# Altium project WSN_NODE.PrjPCB
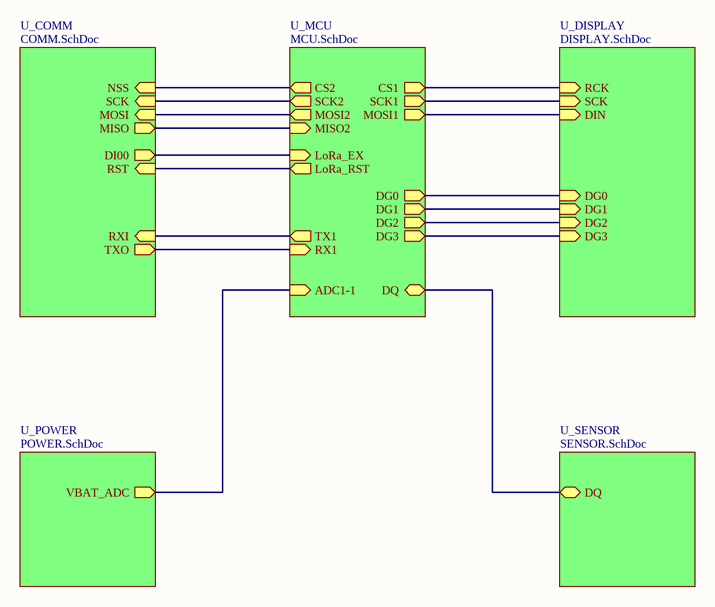
[diagram p0: CONN.SchDoc]
6 sheets, 79 parts. Net scope: hierarchical (ports join the sheet entries above them; power ports are global).
Board file: WSN_PCB_NODE.PcbDoc
Sheets:
  CONN.SchDoc
    U_COMM = COMM.SchDoc
    U_DISPLAY = DISPLAY.SchDoc
    U_MCU = MCU.SchDoc
    U_POWER = POWER.SchDoc
    U_SENSOR = SENSOR.SchDoc

## Sheet CONN.SchDoc: =ProjectName
size A4; CheckedBy: DatNB; Author: Ven; CompanyName: Nacentech; Organization: IMET

### Sub-sheets
U_COMM = COMM.SchDoc: SCK (in), MISO (out), NSS (in), RST (in), TXO (out), RXI (in), DI00 (out), MOSI (in)
U_DISPLAY = DISPLAY.SchDoc: DIN (in), RCK (in), SCK (in), DG0 (in), DG1 (in), DG2 (in), DG3 (in)
U_MCU = MCU.SchDoc: ADC1-1 (in), CS1 (out), SCK1 (out), MOSI1 (out), CS2 (out), TX1 (out), RX1 (in), LoRa_EX (in), SCK2 (out), MISO2 (in), MOSI2 (out), LoRa_RST (out), DG0 (out), DG2 (out), DG3 (out), DG1 (out), DQ (bidir)
U_POWER = POWER.SchDoc: VBAT_ADC (out)
U_SENSOR = SENSOR.SchDoc: DQ (bidir)

### Nets
PA1: sheet U_MCU/ADC1-1, sheet U_POWER/VBAT_ADC
PA4: sheet U_DISPLAY/RCK, sheet U_MCU/CS1
PA5: sheet U_DISPLAY/SCK, sheet U_MCU/SCK1
PA7: sheet U_DISPLAY/DIN, sheet U_MCU/MOSI1
PA8: sheet U_COMM/NSS, sheet U_MCU/CS2
PA9: sheet U_COMM/RXI, sheet U_MCU/TX1
PA10: sheet U_COMM/TXO, sheet U_MCU/RX1
PB0: sheet U_MCU/DQ, sheet U_SENSOR/DQ
PB8: sheet U_DISPLAY/DG0, sheet U_MCU/DG0
PB9: sheet U_DISPLAY/DG1, sheet U_MCU/DG1
PB10: sheet U_DISPLAY/DG2, sheet U_MCU/DG2
PB11: sheet U_DISPLAY/DG3, sheet U_MCU/DG3
PB12: sheet U_COMM/DI00, sheet U_MCU/LoRa_EX
PB13: sheet U_COMM/SCK, sheet U_MCU/SCK2
PB14: sheet U_COMM/MISO, sheet U_MCU/MISO2
PB15: sheet U_COMM/MOSI, sheet U_MCU/MOSI2
NetU2_4: sheet U_COMM/RST, sheet U_MCU/LoRa_RST

### Notes on the sheet
- Project:
- Page Contents:
- Size:
- Date:
- A4
- Checked by:
- Time:
- Revision:
- Sheet
- of
- File:

## Sheet COMM.SchDoc: =ProjectName
size A4; CheckedBy: DatNB; Author: Ven; CompanyName: Nacentech; Organization: IMET
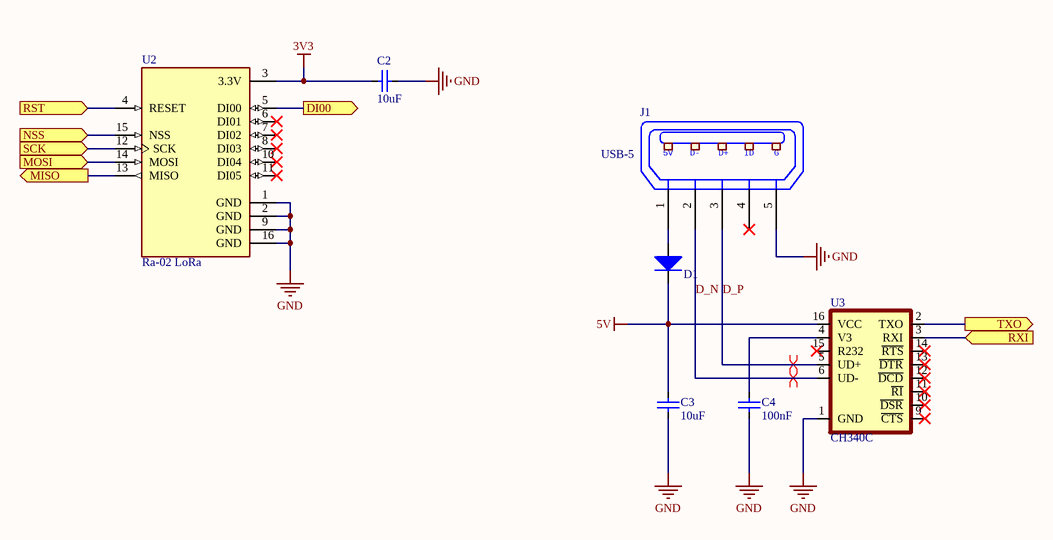
[diagram p1: COMM.SchDoc]

### Parts
C2  10uF  [CAP_0805]
C3  10uF  [CAP_0805]
C4  100nF  [CAP_0805]
D1  Diode SMD  [DIO-214AC(SMA)]  (value not drawn)
J1  USB-5  [USB-M1]
U2  Ra-02 LoRa  [Ra-02]
U3  CH340C  [SOP-16]

### Ports
DI00 (out), MISO (out), MOSI (in), NSS (in), RST (in), RXI (in), SCK (in), TXO (out)

### Nets
3V3: C2.2 U2.3(3.3V)
5V: C3.2 D1.2(K) U3.16(VCC)
GND: C2.1 C3.1 C4.1 J1.5(P5) U2.1(GND) U2.2(GND) U2.9(GND) U2.16(GND) U3.1(GND)
D_N: J1.2(P2) U3.6(UD-)
D_P: J1.3(P3) U3.5(UD+)
PA8: U2.15(NSS) ; port NSS
PA9: U3.3(RXI) ; port RXI
PA10: U3.2(TXO) ; port TXO
PB12: U2.5(DI00) ; port DI00
PB13: U2.12(SCK) ; port SCK
PB14: U2.13(MISO) ; port MISO
PB15: U2.14(MOSI) ; port MOSI
NetC4_2: C4.2 U3.4(V3)
NetD1_1: D1.1(A) J1.1(P1)
NetU2_4: U2.4(RESET) ; port RST

Not connected (* = marked no-connect by the designer): J1 4(P4)*; U2 6(DI01)* 7(DI02)* 8(DI03)* 10(DI04)* 11(DI05)*; U3 9(~{CTS})* 10(~{DSR})* 11(~{RI})* 12(~{DCD})* 13(~{DTR})* 14(~{RTS})* 15(R232)*

### Layout directives
differential pair: D_N, D_P

### Notes on the sheet
- Project:
- Page Contents:
- Size:
- Date:
- A4
- Checked by:
- Time:
- Revision:
- Sheet
- of
- File:
- (in symbol USB-5) 5V; D-; D+; ID; G

### Library data of the parts
C2-C4 = CapSMD: Capacitor; Value: 33p; Published: 8-Jun-2000; LatestRevisionDate: 17-Jul-2002; LatestRevisionNote: Re-released for DXP Platform.; PackageReference: RAD-0.3; Publisher: Altium Limited
D1 = Diode SMD: Default Diode; Code - JEDEC: DO-214-AB; Value: 1N5007; Published: 8-Jun-2000; Revision: July-2002: Re-released for DXP Platform.; Publisher: Altium Limited
J1 = USB-5: Manufacturer: FCI; Manufacturer Part Number: 10118193-0001LF; Connector Type: USB - micro B; Number of Contacts: 5; Gender: Receptacle; Specifications: USB 2.0; .Creator: MM; .Checked PCB: RF; Supplier 1: Digi-Key; RoHS: RoHS Compliant; Category: Connectors, Interconnects; Stock 1: 28642; Pricing 1: 1=0.46, 10=0.433, 25=0.3712, 50=0.3156, 100=0.3032, 250=0.27224, 500=0.25988 (USD); Packaging: Cut Tape (CT); Mounting Type: Surface Mount, Right Angle, Horizontal; Features: Shielded, Solder Retention; Ingress Protection: -; ComponentLink1URL: http://portal.fciconnect.com/Comergent//fci/drawing/10118193.pdf; ComponentLink1Description: http://portal.fciconnect.com/Comergent//fci/drawing/10118193.pdf; Supplier Part Number 1: 609-4616-1-ND; .Checked SCH: MM
U2 = Ra-02 LoRa: LoRa Module Ra-02
U3 = CH340C: USB to serial chip CH340; MF: WCH; Package: Package; Check_prices: https://www.snapeda.com/parts/CH340C/WCH/view-part/5428851/?ref=eda; Value: *; Price: None; MP: CH340C; Availability: Unavailable; SnapEDA_Link: https://www.snapeda.com/parts/CH340C/WCH/view-part/5428851/?ref=snap

## Sheet DISPLAY.SchDoc: =ProjectName
size A4; CheckedBy: DatNB; Author: Ven; CompanyName: Nacentech; Organization: IMET
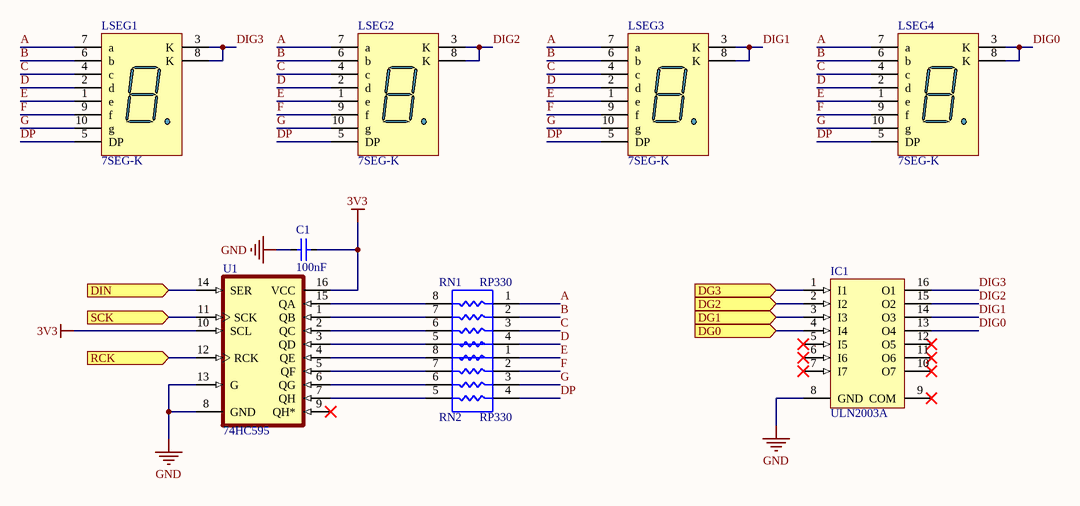
[diagram p2: DISPLAY.SchDoc]

### Parts
C1  100nF  [CAP_0805]
IC1  ULN2003A  [SOIC16]
LSEG1  7SEG-K  [LED7SEG]
LSEG2  7SEG-K  [LED7SEG]
LSEG3  7SEG-K  [LED7SEG]
LSEG4  7SEG-K  [LED7SEG]
RN1  RP330  [RN4-0805]
RN2  RP330  [RN4-0805]
U1  74HC595  [SOIC16]

### Ports
DG0 (in), DG1 (in), DG2 (in), DG3 (in), DIN (in), RCK (in), SCK (in)

### Nets
3V3: C1.1 U1.10(SCL) U1.16(VCC)
GND: C1.2 IC1.8(GND) U1.8(GND) U1.13(G)
A: LSEG1.7(a) LSEG2.7(a) LSEG3.7(a) LSEG4.7(a) RN1.1
B: LSEG1.6(b) LSEG2.6(b) LSEG3.6(b) LSEG4.6(b) RN1.2
C: LSEG1.4(c) LSEG2.4(c) LSEG3.4(c) LSEG4.4(c) RN1.3
D: LSEG1.2(d) LSEG2.2(d) LSEG3.2(d) LSEG4.2(d) RN1.4
DIG0: IC1.13(O4) LSEG4.3(K) LSEG4.8(K)
DIG1: IC1.14(O3) LSEG3.3(K) LSEG3.8(K)
DIG2: IC1.15(O2) LSEG2.3(K) LSEG2.8(K)
DIG3: IC1.16(O1) LSEG1.3(K) LSEG1.8(K)
DP: LSEG1.5(DP) LSEG2.5(DP) LSEG3.5(DP) LSEG4.5(DP) RN2.4
E: LSEG1.1(e) LSEG2.1(e) LSEG3.1(e) LSEG4.1(e) RN2.1
F: LSEG1.9(f) LSEG2.9(f) LSEG3.9(f) LSEG4.9(f) RN2.2
G: LSEG1.10(g) LSEG2.10(g) LSEG3.10(g) LSEG4.10(g) RN2.3
PA4: U1.12(RCK) ; port RCK
PA5: U1.11(SCK) ; port SCK
PA7: U1.14(SER) ; port DIN
PB8: IC1.4(I4) ; port DG0
PB9: IC1.3(I3) ; port DG1
PB10: IC1.2(I2) ; port DG2
PB11: IC1.1(I1) ; port DG3
NetRN1_5: RN1.5 U1.3(QD)
NetRN1_6: RN1.6 U1.2(QC)
NetRN1_7: RN1.7 U1.1(QB)
NetRN1_8: RN1.8 U1.15(QA)
NetRN2_5: RN2.5 U1.7(QH)
NetRN2_6: RN2.6 U1.6(QG)
NetRN2_7: RN2.7 U1.5(QF)
NetRN2_8: RN2.8 U1.4(QE)

Not connected (* = marked no-connect by the designer): IC1 5(I5)* 6(I6)* 7(I7)* 9(COM)* 10(O7)* 11(O6)* 12(O5)*; U1 9(QH*)*

### Notes on the sheet
- Project:
- Page Contents:
- Size:
- Date:
- A4
- Checked by:
- Time:
- Revision:
- Sheet
- of
- File:

### Library data of the parts
C1 = CapSMD: Capacitor; Value: 33p; Published: 8-Jun-2000; LatestRevisionDate: 17-Jul-2002; LatestRevisionNote: Re-released for DXP Platform.; PackageReference: RAD-0.3; Publisher: Altium Limited
IC1 = ULN2003A: High-Voltage, High-Current Darlington Array; LatestRevisionNote: Stylized 3D Model Added.; Publisher: Altium Limited; Value: ULN2003A
LSEG1-LSEG4 = LED7SEG-K: 14.2 mm General Purpose Blue 7-Segment Display: CC, RH DP, Gray Surface; MinimumIntensity: 2020 ucd; Note: IF = 10 mA; Published: 8-Jun-2000; LatestRevisionDate: 17-Dec-2003; LatestRevisionNote: Schematic revised, PCB Footprint replaced.; DatasheetDocument: 24-Sep-2002; PackageDocument: 24-Sep-2002; PackageReference: H; Publisher: Altium Limited; Colour: Blue; ComponentLink1Description: Manufacturer Link; ComponentLink1URL: http://www.agilent.com/
RN1 RN2 = RN4-Dual
U1 = 74HC595: 8-bit Serial-Input/Serial or Parallel Output Shift Register with Latched 3-state Outputs

## Sheet MCU.SchDoc: =ProjectName
size A4; CheckedBy: DatNB; Author: Ven; CompanyName: Nacentech; Organization: IMET
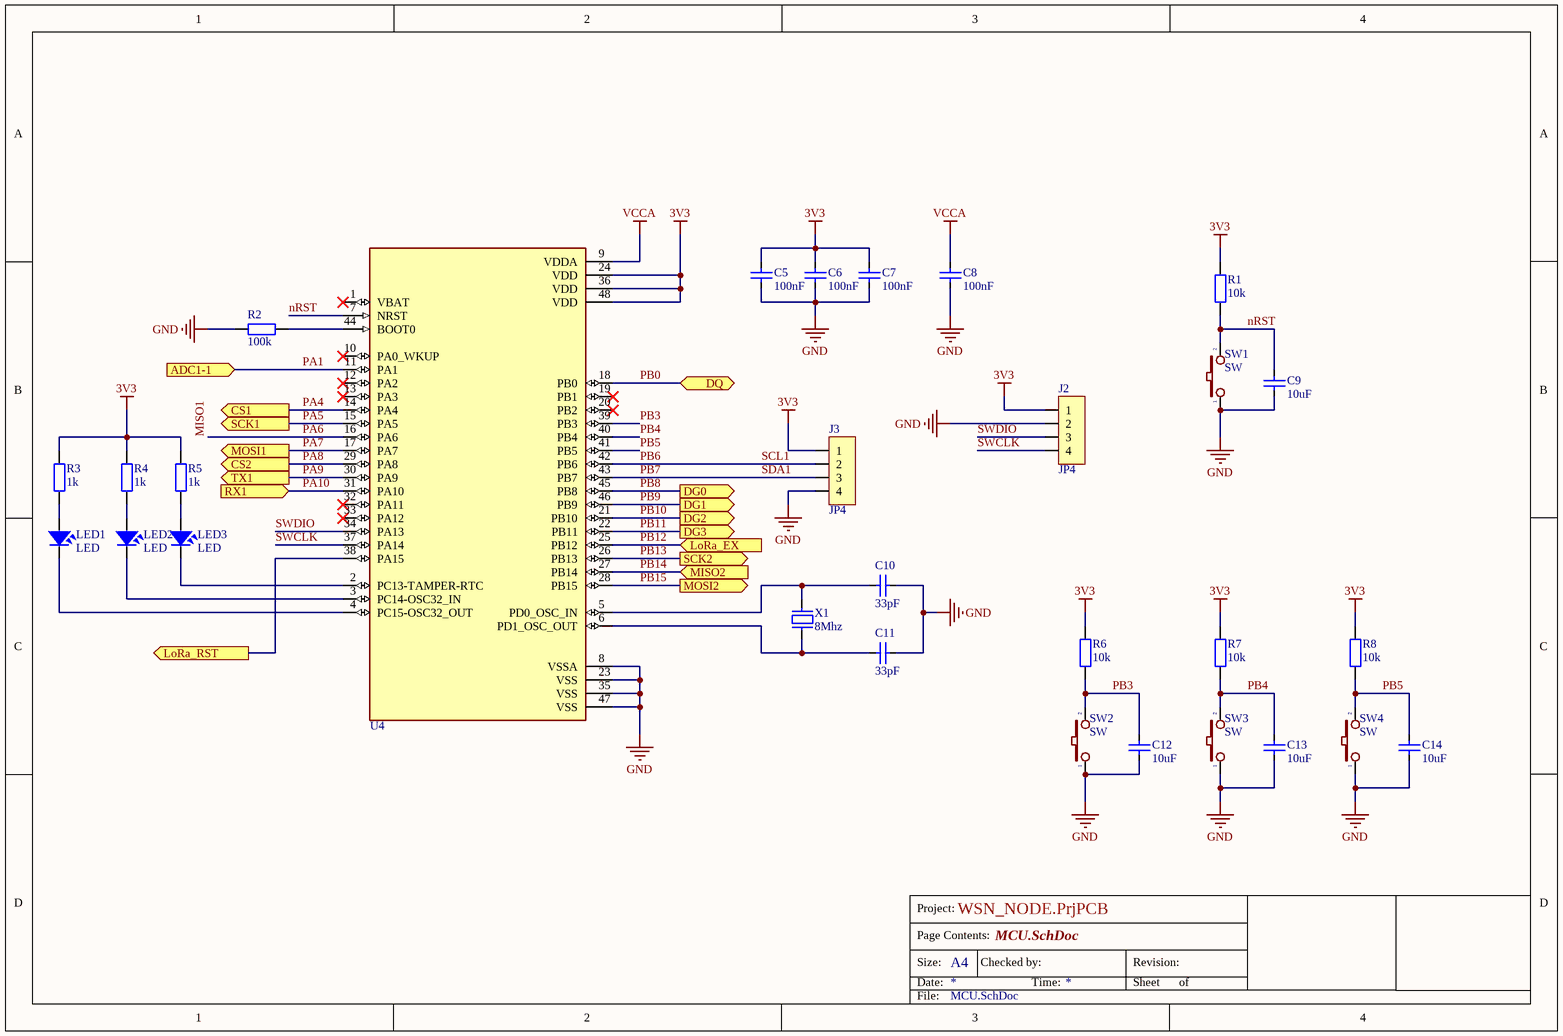
[diagram p3: MCU.SchDoc]

### Parts
C5  100nF  [CAP_0805]
C6  100nF  [CAP_0805]
C7  100nF  [CAP_0805]
C8  100nF  [CAP_0805]
C9  10uF  [CAP_0805]
C10  33pF  [CAP_0805]
C11  33pF  [CAP_0805]
C12  10uF  [CAP_0805]
C13  10uF  [CAP_0805]
C14  10uF  [CAP_0805]
J2  JP4  [JP4-C1T]
J3  JP4  [JP4-C1T]
LED1  LED  [LED-0805-Red]
LED2  LED  [LED-0805-Yellow]
LED3  LED  [LED-0805-Green]
R1  10k  [RES-SMD-0805]
R2  100k  [RES-SMD-0805]
R3  1k  [RES-SMD-0805]
R4  1k  [RES-SMD-0805]
R5  1k  [RES-SMD-0805]
R6  10k  [RES-SMD-0805]
R7  10k  [RES-SMD-0805]
R8  10k  [RES-SMD-0805]
SW1  SW  [SW 3x2x4]
SW2  SW  [SW2]
SW3  SW  [SW2]
SW4  SW  [SW2]
U4  STM32  [LQFP 48]  (value not drawn)
X1  8Mhz  [XTAL 5032 SMD]

### Ports
ADC1-1 (in), CS1 (out), CS2 (out), DG0 (out), DG1 (out), DG2 (out), DG3 (out), DQ (bidir), LoRa_EX (in), LoRa_RST (out), MISO2 (in), MOSI1 (out), MOSI2 (out), RX1 (in), SCK1 (out), SCK2 (out), TX1 (out)

### Nets
3V3: C5.2 C6.2 C7.2 J2.1 J3.1 R1.1 R3.1 R4.1 R5.1 R6.1 R7.1 R8.1 U4.24(VDD) U4.36(VDD) U4.48(VDD)
GND: C5.1 C6.1 C7.1 C8.1 C9.1 C10.2 C11.2 C12.1 C13.1 C14.1 J2.2 J3.4 R2.1 SW1.1 SW2.1 SW3.1 SW4.1 U4.8(VSSA) U4.23(VSS) U4.35(VSS) U4.47(VSS)
VCCA: C8.2 U4.9(VDDA)
MISO1: U4.16(PA6)  [also labelled PA6]
nRST: C9.2 R1.2 SW1.2 U4.7(NRST)
PA1: U4.11(PA1) ; port ADC1-1
PA4: U4.14(PA4) ; port CS1
PA5: U4.15(PA5) ; port SCK1
PA7: U4.17(PA7) ; port MOSI1
PA8: U4.29(PA8) ; port CS2
PA9: U4.30(PA9) ; port TX1
PA10: U4.31(PA10) ; port RX1
PB0: U4.18(PB0) ; port DQ
PB3: C12.2 R6.2 SW2.2 U4.39(PB3)
PB4: C13.2 R7.2 SW3.2 U4.40(PB4)
PB5: C14.2 R8.2 SW4.2 U4.41(PB5)
PB6: J3.2 U4.42(PB6)  [also labelled SCL1]
PB7: J3.3 U4.43(PB7)  [also labelled SDA1]
PB8: U4.45(PB8) ; port DG0
PB9: U4.46(PB9) ; port DG1
PB10: U4.21(PB10) ; port DG2
PB11: U4.22(PB11) ; port DG3
PB12: U4.25(PB12) ; port LoRa_EX
PB13: U4.26(PB13) ; port SCK2
PB14: U4.27(PB14) ; port MISO2
PB15: U4.28(PB15) ; port MOSI2
SWCLK: J2.4 U4.37(PA14)
SWDIO: J2.3 U4.34(PA13)
NetC10_1: C10.1 U4.5(PD0_OSC_IN) X1.2
NetC11_1: C11.1 U4.6(PD1_OSC_OUT) X1.1
NetLED1_1: LED1.1 R3.2
NetLED1_2: LED1.2 U4.4(PC15-OSC32_OUT)
NetLED2_1: LED2.1 R4.2
NetLED2_2: LED2.2 U4.3(PC14-OSC32_IN)
NetLED3_1: LED3.1 R5.2
NetLED3_2: LED3.2 U4.2(PC13-TAMPER-RTC)
NetR2_2: R2.2 U4.44(BOOT0)
NetU2_4: U4.38(PA15) ; port LoRa_RST

Not connected (* = marked no-connect by the designer): U4 1(VBAT)* 10(PA0_WKUP)* 12(PA2)* 13(PA3)* 19(PB1)* 20(PB2)* 32(PA11)* 33(PA12)*

### Notes on the sheet
- Project:
- Page Contents:
- Size:
- Date:
- A4
- Checked by:
- Time:
- Revision:
- Sheet
- of
- File:

### Library data of the parts
C5-C14 = CapSMD: Capacitor; Value: 33p; Published: 8-Jun-2000; LatestRevisionDate: 17-Jul-2002; LatestRevisionNote: Re-released for DXP Platform.; PackageReference: RAD-0.3; Publisher: Altium Limited
J2 J3 = JP4: WR-PHD 2.54 mm Angled Socket Header; Manufacturer: W¨¹rth Elektronik eiSos GmbH; partNo: 613004143121; ComponentLink1 Description: Manufacturer; ComponentLink2 Description: Datasheet; NoPins: 04; Created Date: 29 March 2013; ComponentLink1URL: http://www.we-online.com; ComponentLink2URL: http://katalog.we-online.de/em/datasheet/6130xx143121.pdf; Created by: Karrer Zheng
LED1-LED3 = LED: LED Single colour Green and Red; Value: LED 3 ly Single Colour
R1-R8 = Resistor - SMD: Resistor SMD; Manufacturer: Generic Components; Class: Passive; Published: 08/06/2000; Publisher: Altium Hobart Technology Centre
SW1-SW4 = SW2: Switch button 2 pin; Value: SW chip 2 pin
U4 = STM32F103C8T6: STM32 ARM-based 32-bit MCU with 64 Kbytes Flash, 64-pin LQFP, Industrial Temperature
X1 = XT2: Crystal For all Crystal 2pin.; Value: 4Mhz

## Sheet POWER.SchDoc: =ProjectName
size A4; CheckedBy: DatNB; Author: Ven; CompanyName: Nacentech; Organization: IMET
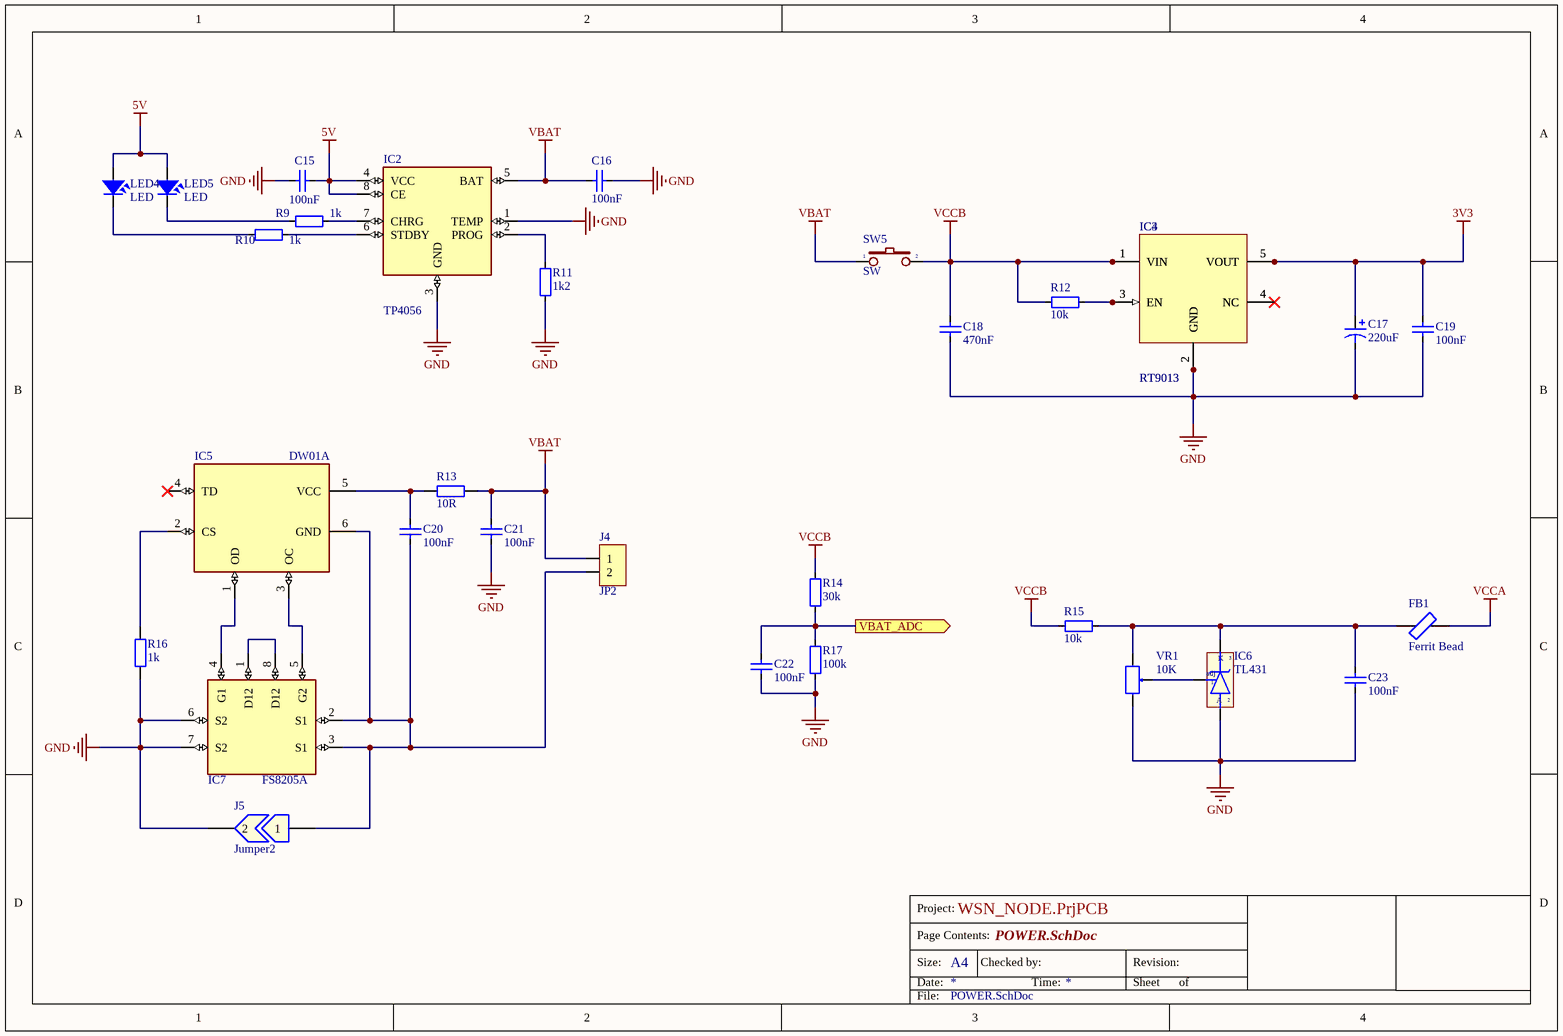
[diagram p4: POWER.SchDoc]

### Parts
C15  100nF  [CAP_0805]
C16  100nF  [CAP_0805]
C17  220uF  [CAP_TANTALUM_3216]
C18  470nF  [CAP_0805]
C19  100nF  [CAP_0805]
C20  100nF  [CAP_0805]
C21  100nF  [CAP_0805]
C22  100nF  [CAP_0805]
C23  100nF  [CAP_0805]
FB1  Ferrit Bead  [RES-SMD-0805]
IC2  TP4056  [TP4056]
IC3  RT9013  [SOT23-5]
IC4  RT9013  [SOT23-5]
IC5  DW01A  [SOT23-6]
IC6  TL431  [qto-92]
IC7  FS8205A  [FS8205A]
J4  JP2  [JP2-D1T]
J5  Jumper2  [RES-SMD-0201]
LED4  LED  [LED-0805-Red]
LED5  LED  [LED-0805-Green]
R9  1k  [RES-SMD-0805]
R10  1k  [RES-SMD-0805]
R11  1k2  [RES-SMD-0805]
R12  10k  [RES-SMD-0805]
R13  10R  [RES-SMD-0805]
R14  30k  [RES-SMD-0805]
R15  10k  [RES-SMD-0805]
R16  1k  [RES-SMD-0805]
R17  100k  [RES-SMD-0805]
SW5  SW  [JP2-D1T]
VR1  10K  [VR1]

### Ports
VBAT_ADC (out)

### Nets
3V3: C17.1 C19.1 IC3.5(VOUT) IC4.5(VOUT)
5V: C15.1 IC2.4(VCC) IC2.8(CE) LED4.1 LED5.1
GND: C15.2 C16.1 C17.2 C18.2 C19.2 C21.1 C22.1 C23.2 IC2.1(TEMP) IC2.3(GND) IC3.2(GND) IC4.2(GND) IC6.2(A) IC7.6(S2) IC7.7(S2) J5.2 R11.1 R16.2 R17.2 VR1.3
VBAT: C16.2 C21.2 IC2.5(BAT) J4.1 R13.2 SW5.1
VCCA: FB1.2
VCCB: C18.1 IC3.1(VIN) IC4.1(VIN) R12.2 R14.1 R15.2 SW5.2
PA1: C22.2 R14.2 R17.1 ; port VBAT_ADC
NetC20_1: C20.1 IC5.6(GND) IC7.2(S1) IC7.3(S1) J4.2 J5.1
NetC20_2: C20.2 IC5.5(VCC) R13.1
NetC23_1: C23.1 FB1.1 IC6.3(K) R15.1 VR1.1
NetIC2_2: IC2.2(PROG) R11.2
NetIC2_6: IC2.6(STDBY) R10.1
NetIC2_7: IC2.7(CHRG) R9.1
NetIC3_3: IC3.3(EN) IC4.3(EN) R12.1
NetIC3_4: IC3.4(NC) IC4.4(NC)
NetIC5_1: IC5.1(OD) IC7.4(G1)
NetIC5_2: IC5.2(CS) R16.1
NetIC5_3: IC5.3(OC) IC7.5(G2)
NetIC6_1: IC6.1(adj) VR1.2
NetIC7_1: IC7.1(D12) IC7.8(D12)
NetLED4_2: LED4.2 R10.2
NetLED5_2: LED5.2 R9.2

Not connected (* = marked no-connect by the designer): IC5 4(TD)*

### Notes on the sheet
- Project:
- Page Contents:
- Size:
- Date:
- A4
- Checked by:
- Time:
- Revision:
- Sheet
- of
- File:

### Library data of the parts
C15 C16 C18-C23 = CapSMD: Capacitor; Value: 33p; Published: 8-Jun-2000; LatestRevisionDate: 17-Jul-2002; LatestRevisionNote: Re-released for DXP Platform.; PackageReference: RAD-0.3; Publisher: Altium Limited
C17 = Cap Pol: Polarized Capacitor (Axial); Published: 8-Jun-2000; LatestRevisionDate: 17-Jul-2002; LatestRevisionNote: Re-released for DXP Platform.; PackageReference: POLAR0.8; Publisher: Altium Limited
FB1 = Ferrit Bead: Generic Ferrit Bead
IC2 = TP4056: Complete single cell Li-Ion battery with a constant current / constant voltage linear charger
IC3 IC4 = RT9013: RT9013-33GB IC REG LINEAR 3.3V 500mA SOT23-5
IC5 = DW01A: One Cell Lithium-ion/Polymer Battery Protection IC
IC6 = TL431: Programmable Shunt Regulator; Value: TL431
J4 = JP2: WR-PHD 2.54 mm Angled Socket Header; Manufacturer: W¨¹rth Elektronik eiSos GmbH; partNo: 613002143121; ComponentLink1 Description: Manufacturer; ComponentLink2 Description: Datasheet; NoPins: 02; Created Date: 29 March 2013; ComponentLink1URL: http://www.we-online.com; ComponentLink2URL: http://katalog.we-online.de/em/datasheet/6130xx143121.pdf; Created by: Karrer Zheng
J5 = Jumper2: Jumper, 2-Pin
LED4 LED5 = LED: as LED1 on sheet MCU
R9-R12 R14 R15 R17 = Resistor - SMD: Resistor; Manufacturer: Generic Components; Class: Passive; Published: 08/06/2000; Publisher: Altium Hobart Technology Centre
R13 R16 = Resistor - SMD: as R1 on sheet MCU; Published: 08/06/2000; Publisher: Altium Hobart Technology Centre
SW5 = SW2: as SW1 on sheet MCU
VR1 = VR: Var Resistor; Value: VR 10K

## Sheet SENSOR.SchDoc: =ProjectName
size A4; CheckedBy: DatNB; Author: Ven; CompanyName: Nacentech; Organization: IMET
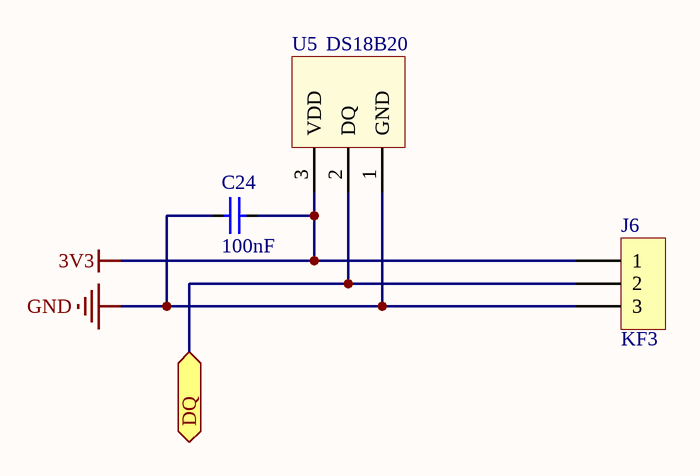
[diagram p5: SENSOR.SchDoc]

### Parts
C24  100nF  [CAP_0805]
J6  KF3  [KF3-5.08]
U5  DS18B20  [QTO-92A]

### Ports
DQ (bidir)

### Nets
3V3: C24.1 J6.1 U5.3(VDD)
GND: C24.2 J6.3 U5.1(GND)
PB0: J6.2 U5.2(DQ) ; port DQ

### Notes on the sheet
- Project:
- Page Contents:
- Size:
- Date:
- A4
- Checked by:
- Time:
- Revision:
- Sheet
- of
- File:

### Library data of the parts
C24 = CapSMD: Capacitor; Value: 33p; Published: 8-Jun-2000; LatestRevisionDate: 17-Jul-2002; LatestRevisionNote: Re-released for DXP Platform.; PackageReference: RAD-0.3; Publisher: Altium Limited
J6 = KF3: Manufacturer: Würth Elektronik eiSos GmbH; partNo: 691103110003; ComponentLink1 Description: Manufacturer; ComponentLink2 Description: Datasheet; NoPins: 3; Created Date: 29 October 2013; ComponentLink1URL: http://www.we-online.com; ComponentLink2URL: http://katalog.we-online.de/em/datasheet/6911031100xx.pdf; Created by: Karrer Zheng
U5 = DS18B20: High Precision  1-Wire® Digital Thermometer

## Nets that join several sheets
3V3: COMM (C2.2 U2.3), DISPLAY (C1.1 U1.10 U1.16), MCU (15 pins), POWER (C17.1 C19.1 IC3.5 IC4.5), SENSOR (C24.1 J6.1 U5.3)
5V: COMM (C3.2 D1.2 U3.16), POWER (5 pins)
GND: COMM (9 pins), DISPLAY (C1.2 IC1.8 U1.8 U1.13), MCU (21 pins), POWER (20 pins), SENSOR (C24.2 J6.3 U5.1)
VCCA: MCU (C8.2 U4.9), POWER (FB1.2)
NetU2_4: COMM (U2.4), MCU (U4.38)
PA1: MCU (U4.11), POWER (C22.2 R14.2 R17.1)
PA4: DISPLAY (U1.12), MCU (U4.14)
PA5: DISPLAY (U1.11), MCU (U4.15)
PA7: DISPLAY (U1.14), MCU (U4.17)
PA8: COMM (U2.15), MCU (U4.29)
PA9: COMM (U3.3), MCU (U4.30)
PA10: COMM (U3.2), MCU (U4.31)
PB0: MCU (U4.18), SENSOR (J6.2 U5.2)
PB8: DISPLAY (IC1.4), MCU (U4.45)
PB9: DISPLAY (IC1.3), MCU (U4.46)
PB10: DISPLAY (IC1.2), MCU (U4.21)
PB11: DISPLAY (IC1.1), MCU (U4.22)
PB12: COMM (U2.5), MCU (U4.25)
PB13: COMM (U2.12), MCU (U4.26)
PB14: COMM (U2.13), MCU (U4.27)
PB15: COMM (U2.14), MCU (U4.28)